# EAGLE design Speedometer (EAGLE 9.6.2)
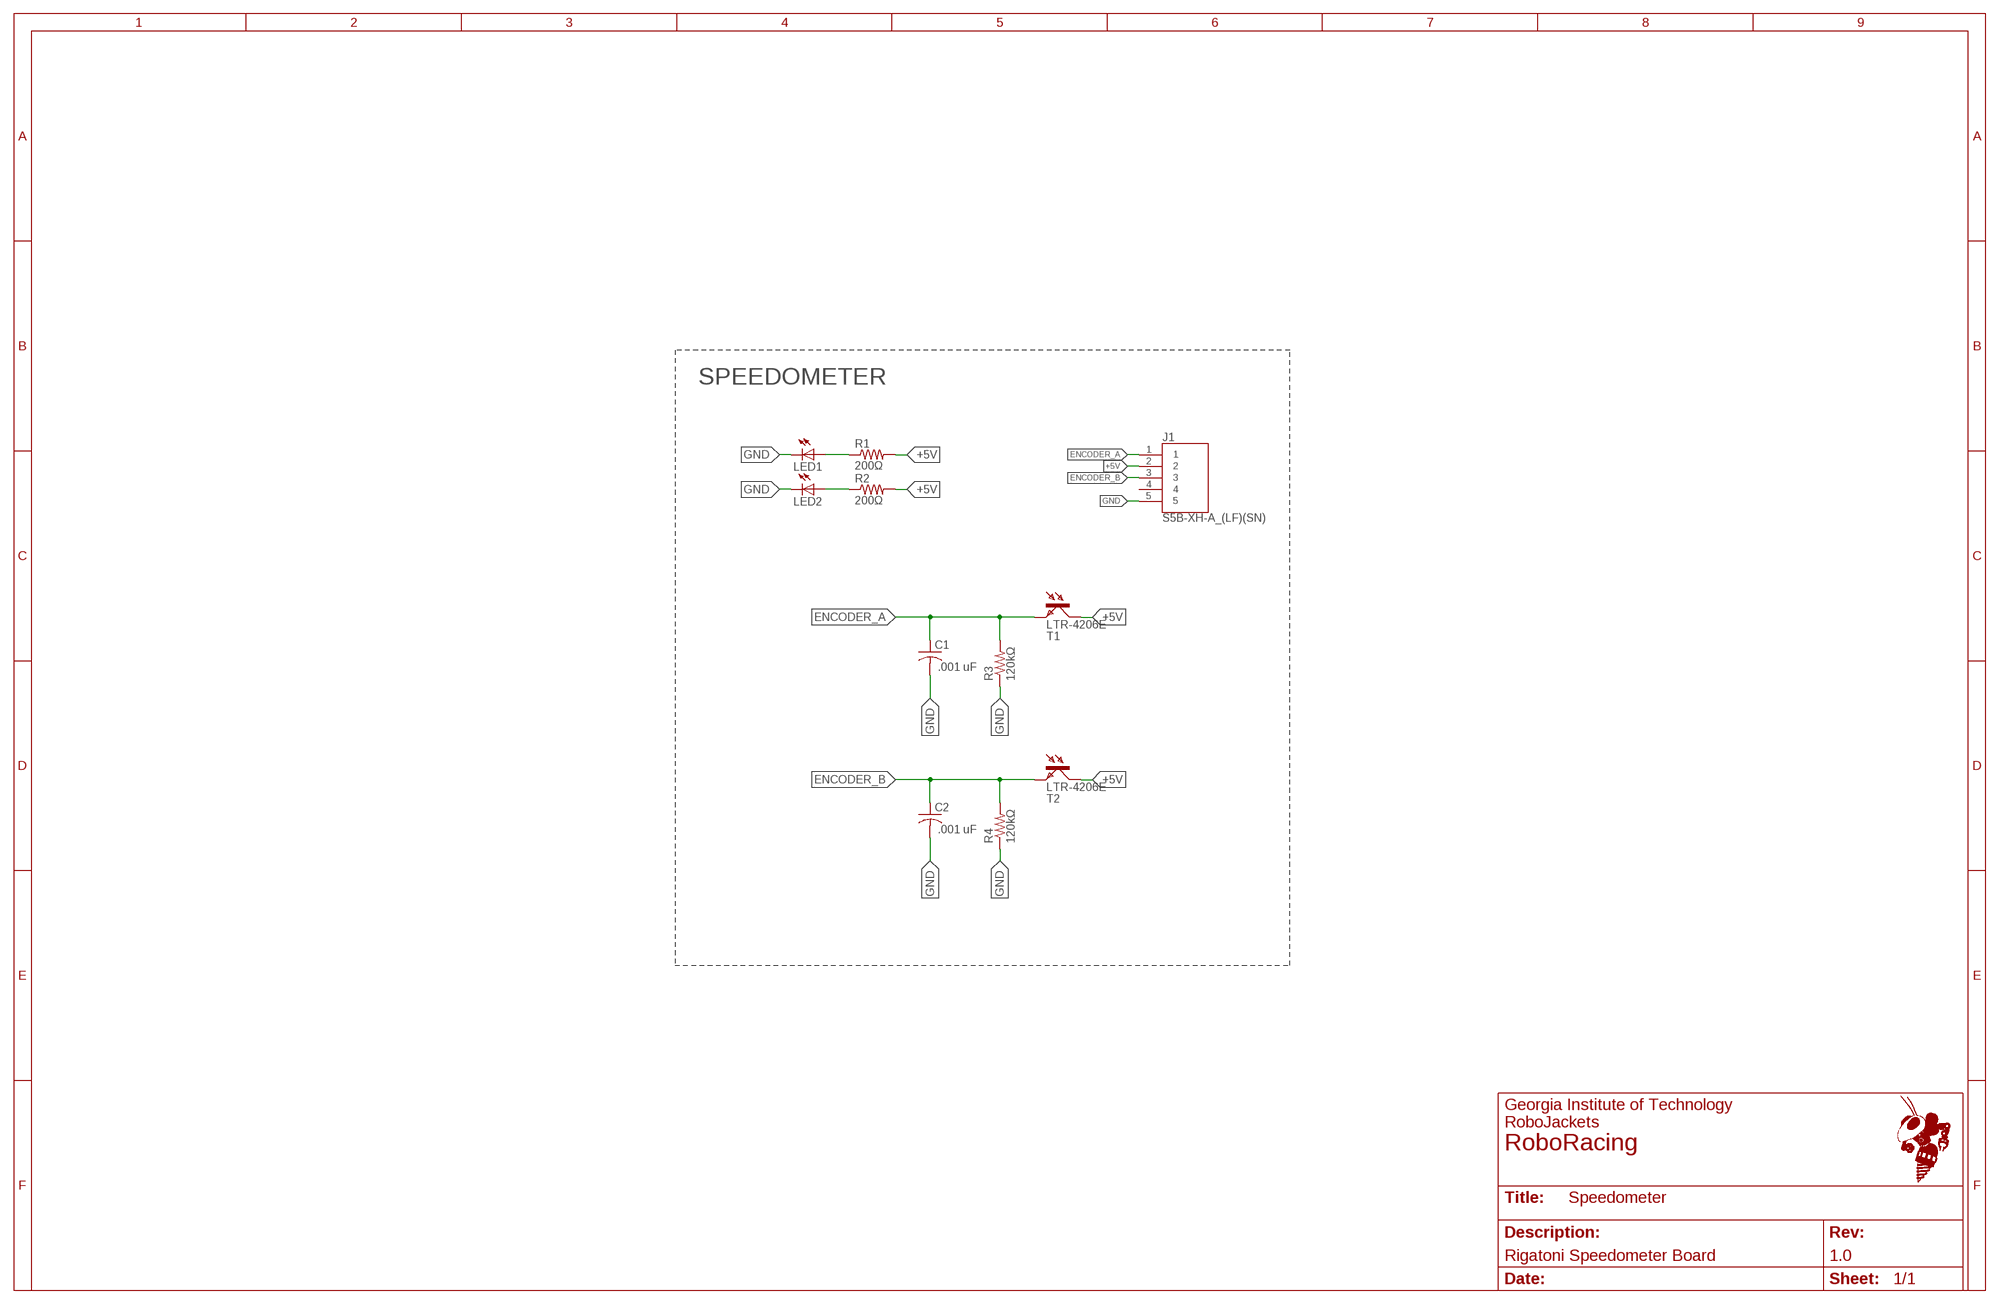
[diagram p0: schematic, sheet 1]
FRAME1 (FRAME_11_17): REVISION: 1.0; SCH_DESC: Rigatoni Speedometer Board; TEAM: RoboRacing

## Parts
C1  .001 uF  C-USC0603  [C0603]
C2  .001 uF  C-USC0603  [C0603]
J1  S5B-XH-A_(LF)(SN)  [SHDR5W80P0X250_1X5_1490X1150X6]
LED1  LED3MM  [LED3MM]
LED2  LED3MM  [LED3MM]
R1  200Ω  R-US_R0603  [R0603]
R2  200Ω  R-US_R0603  [R0603]
R3  120kΩ  R-US_R0603  [R0603]
R4  120kΩ  R-US_R0603  [R0603]
T1  LTR-4206E  [BPX81]
T2  LTR-4206E  [BPX81]

## Nets
+5V: J1.2 R1.2 R2.2 T1.C T2.C
ENCODER_A: C1.1 J1.1 R3.2 T1.E
ENCODER_B: C2.1 J1.3 R4.2 T2.E
GND: C1.2 C2.2 J1.5 LED1.K(C) LED2.K(C) R3.1 R4.1
N$1: LED1.A R1.1
N$2: LED2.A R2.1
Unconnected: J1.4

## Notes on the sheet
- SPEEDOMETER

## Library data of the parts
C1 C2 = rcl:C-US: CAPACITOR, American symbol; SPICEPREFIX: C
J1 = RoboJackets-Connectors:S5B-XH-A_(LF)(SN): JST XH Series, 2.5mm Pitch 5 Way 1 Row Right Angle PCB Header, Through Hole, Solder Termination Source: Datasheet <http://www.jst-mfg.com/product/pdf/eng/eXH.pdf>; DESCRIPTION: JST XH Series, 2.5mm Pitch 5 Way 1 Row Right Angle PCB Header, Through Hole, Solder Termination; HEIGHT: 6.1mm; MANUFACTURER_NAME: JST (JAPAN SOLDERLESS TERMINALS); MANUFACTURER_PART_NUMBER: S5B-XH-A (LF)(SN); RS_PART_NUMBER: 5469072; RS_PRICE-STOCK: http://uk.rs-online.com/web/p/products/5469072
LED1 LED2 = adafruit:LED: LED OSRAM: - CHIPLED LG R971, LG N971, LY N971, LG Q971, LY Q971, LO R971, LY R971 LH N974, LH R974 LS Q976, LO Q976, LY Q976 LO Q996 - Hyper CHIPLED LW Q18S LB Q993, LB Q99A, LB R99A - SideLED LS A670, LO A670, LY A670, LG A670, LP A670 LB A673, LV A673, LT A673, LW A673 LH A674 LY A675 LS A676, LA A676, LO A676, LY A676, LW A676 LS A679, LY A679, LG A679 - Hyper Micro SIDELED® LS Y876, LA Y876, LO Y876, LY Y876 LT Y87S - SmartLED LW L88C, LW L88S LB L89C, LB L89S, LG L890 LS L89K, LO L89K, LY L89K LS L896, LA L896, LO L896, LY L896 - TOPLED LS T670, LO T670, LY T670, LG T670, LP T670 LSG T670, LSP T670, LSY T670, LOP T670, LYG T670 LG T671, LOG T671, LSG T671 LB T673, LV T673, LT T673, LW T673 LH T674 LS T676, LA T676, LO T676, LY T676, LB T676, LH T676, LSB T676, LW T676 LB T67C, LV T67C, LT T67C, LS T67K, LO T67K, LY T67K, LW E67C LS E67B, LA E67B, LO E67B, LY E67B, LB E67C, LV E67C, LT E67C LW T67C LS T679, LY T679, LG T679 LS T770, LO T770, LY T770, LG T770, LP T770 LB T773, LV T773, LT T773, LW T773 LH T774 LS E675, LA E675, LY E675, LS T675 LS T776, LA T776, LO T776, LY T776, LB T776 LHGB T686 LT T68C, LB T68C - Hyper Mini TOPLED® LB M676 - Mini TOPLED Santana® LG M470 LS M47K, LO M47K, LY M47K Source: http://www.osram.convergy.de/
R1-R4 = rcl:R-US_: RESISTOR, American symbol; SPICEPREFIX: R
T1 T2 = LTR-4206E:LTR-4206E: PHOTO TRANSISTOR Check prices <https://pricing.snapeda.com/parts/LTR-4206E/Lite-On%20Inc./view-part?ref=eda>; AVAILABILITY: In Stock; DESCRIPTION: Phototransistors 940nm Top View T-1; MF: Lite-On Inc.; MP: LTR-4206E; PACKAGE: T-1 Lite-On; PRICE: None

## Board
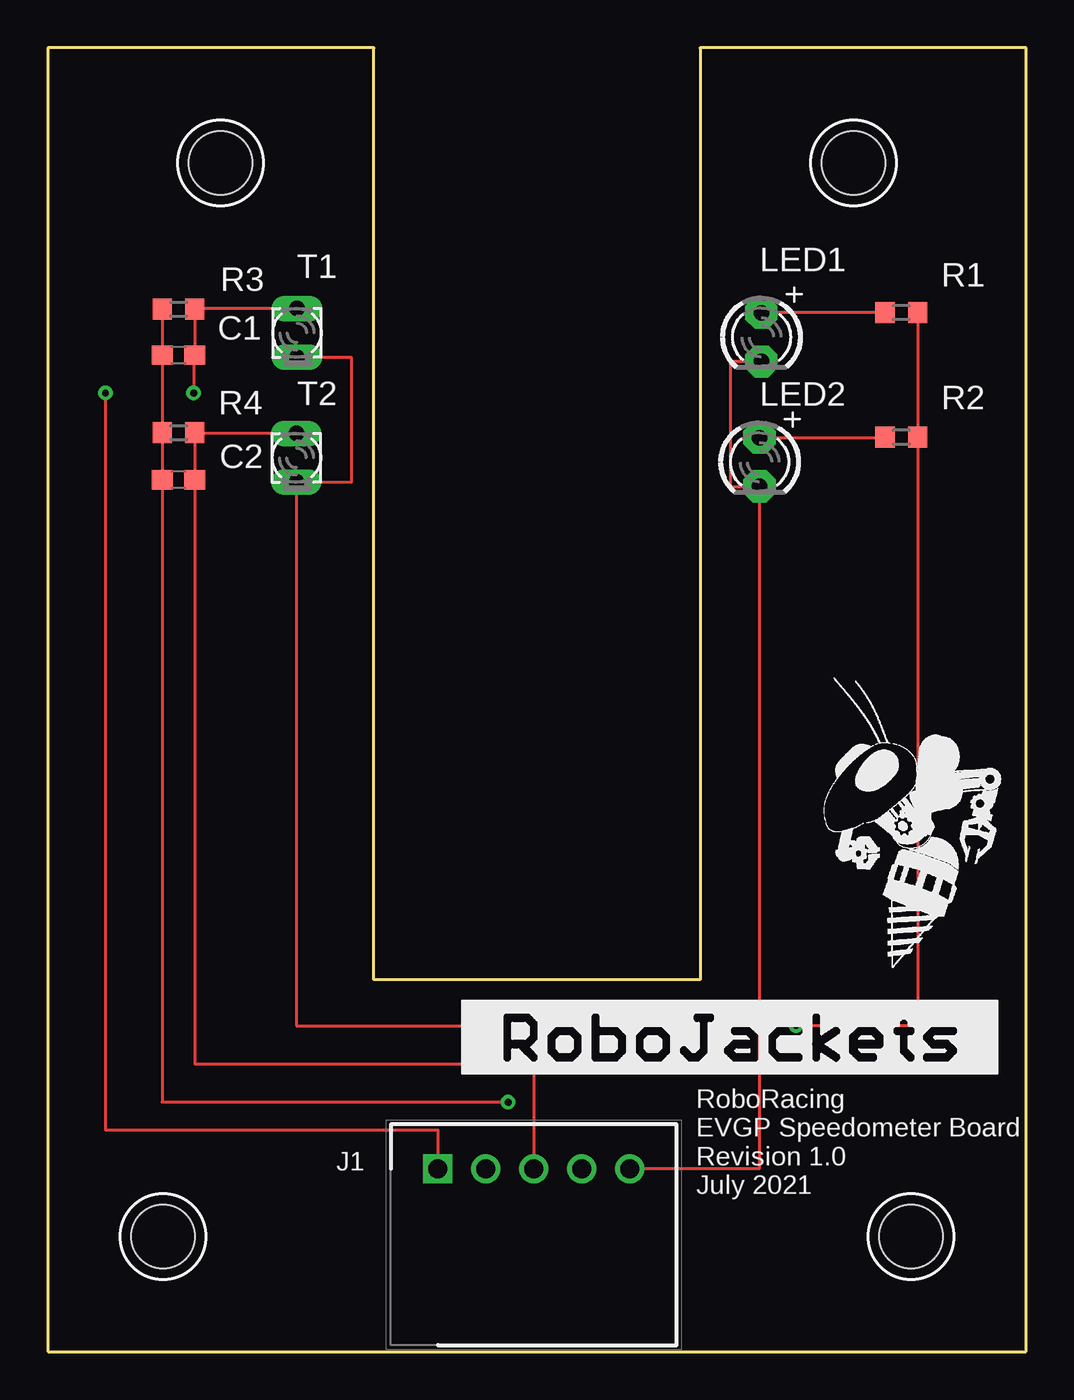
[diagram p1: board, top side]
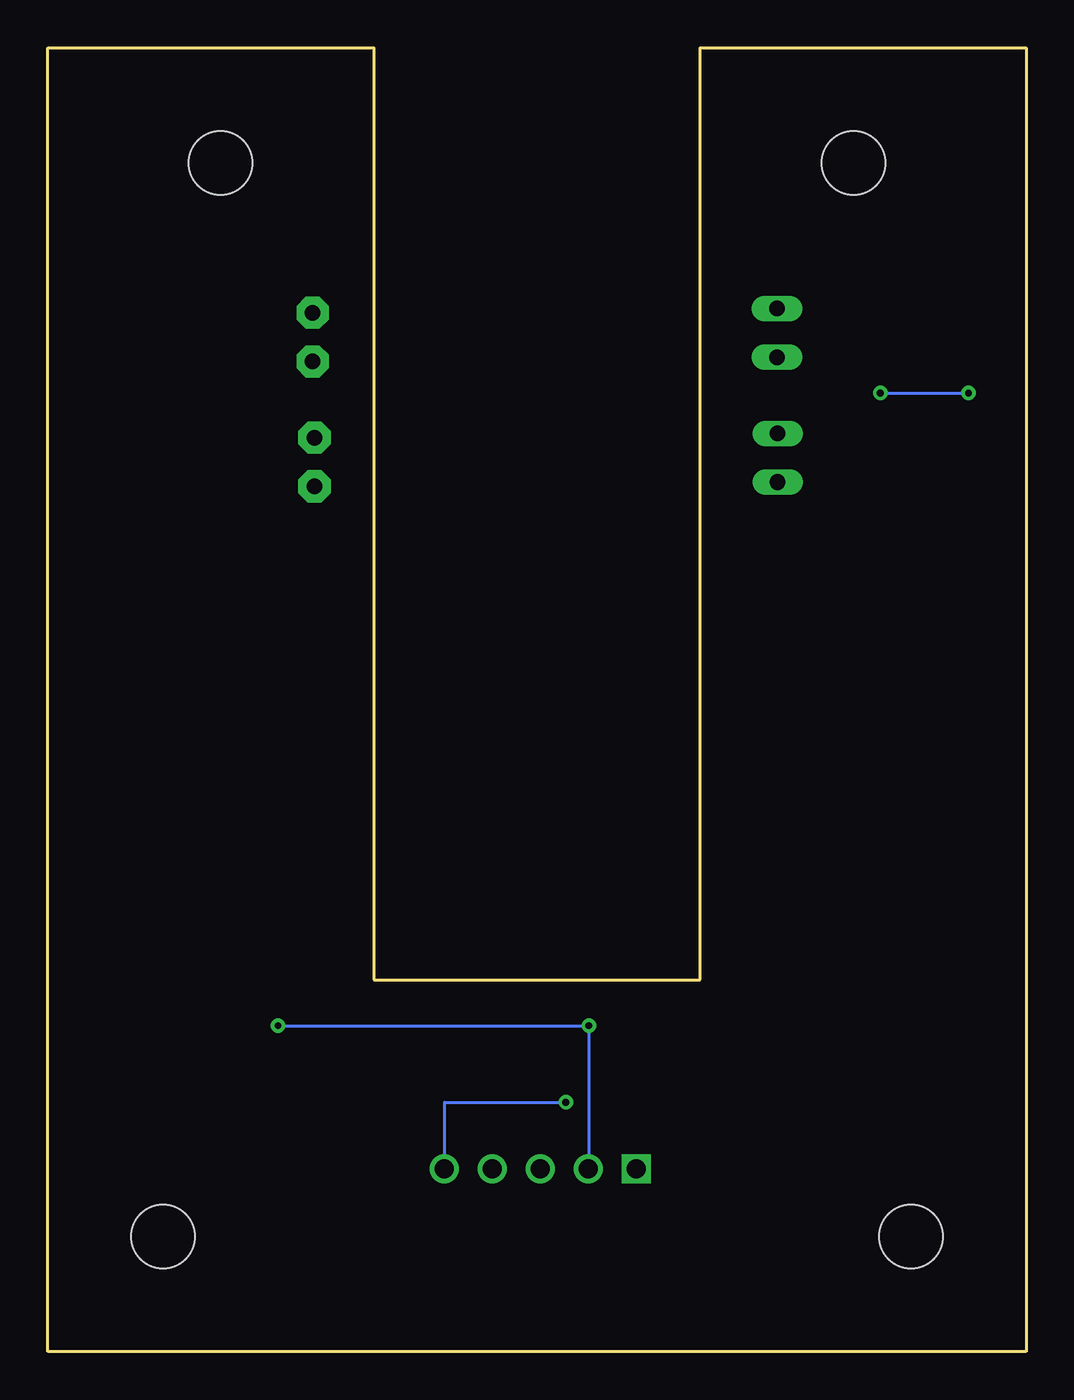
[diagram p2: board, bottom side, seen from below]

Size 51 x 68 mm. Coordinates in mm from the lower left corner, seen from the top.
Outline: 0,0 51,0 51,68 34,68 34,19.4 17,19.4 17,68 0,68 0,0
Copper layers (1*16): Top 0.035mm / dielectric 1.5mm / Bottom 0.035mm
Design rules "default": minimum track width 6mil, minimum drill 0.35mm, track to track 6mil, track to pad 6mil, pad to pad 6mil, via to via 6mil, smd to smd 6mil, copper to edge 40mil, drill to drill 6mil, minimum pad ring 10mil, minimum via ring 8mil, stop-mask expansion 4mil, vias tented up to drill 0mil, thermal gap 10mil
Holes 3.3 mm at 6,6 45,6 42,62 9,62

### Footprints (pad centres in the part's own frame; a part is rotated, then mirrored left to right if it is on the bottom)
C0603 = smd 1.1 x 1: 1 -0.85,0; 2 0.85,0
SHDR5W80P0X250_1X5_1490X1150X6 = drill 1 pad 1.5 square: 1 -5,3 | drill 1 pad 1.5: 2 -2.5,3; 3 0,3; 4 2.5,3; 5 5,3
LED3MM = drill 0.813 pad 1.676 octagon: A -1.27,0; K 1.27,0
R0603 = smd 1 x 1.1: 1 -0.85,0; 2 0.85,0
BPX81 = drill 0.813 long: C 1.27,0; E -1.27,0

### Placement (x,y rotation side)
C1  6.81,51.97 180 top
C2  6.81,45.47 180 top
J1  25.33,6.54 0 top
LED1  37.2,52.91 270 top
LED2  37.1,46.4 270 top
R1  44.5,54.2 0 top
R2  44.5,47.7 0 top
R3  6.81,54.37 0 top
R4  6.81,47.93 0 top
T1  12.98,53.14 270 top
T2  12.95,46.62 270 top
U$1  [ROBOBUZZ_0.8X]  44,20 0 top
U$2  [ROBOJACKETS]  21.6,14.5 0 top

### Tracks (layer width: path | path; a pad name or v marks a point on that pad's centre or on a via)
+5V  (via drill 0.35)
  Top 0.152: R1.2 R2.2 | R2.2 | T1.C 15.83,51.87 15.83,45.35 T2.C 12.95,17 v22.8,17 | R2.2 45.35,17 v39,17
  Bottom 0.152: J1.2 22.8,9.54 v22.8,17 v39,17
ENCODER_A  (via drill 0.35)
  Top 0.152: v7.6,50 7.6,52 7.63,52 C1.1 R3.2 7.7,54.41 T1.E | v3,50 3,11.54 20.33,11.54 J1.1
  Bottom 0.152: v7.6,50 v3,50
ENCODER_B
  Top 0.152: J1.3 25.33,15 7.66,15 C2.1 R4.2 7.7,47.89 T2.E
GND  (via drill 0.35)
  Top 0.152: LED1.K 35.58,51.64 35.58,45.13 LED2.K 37.1,9.54 J1.5 | R3.1 C1.2 R4.1 C2.2 5.96,13 v24,13
  Bottom 0.152: v24,13 30.33,13 J1.5
N$1
  Top 0.152: 43.47,54.38 R1.1 43.63,54.18 LED1.A
N$2
  Top 0.152: LED2.A 43.65,47.67 R2.1

### Text on the board
tPlace: RoboRacing / EVGP Speedometer Board / Revision 1.0 / July 2021